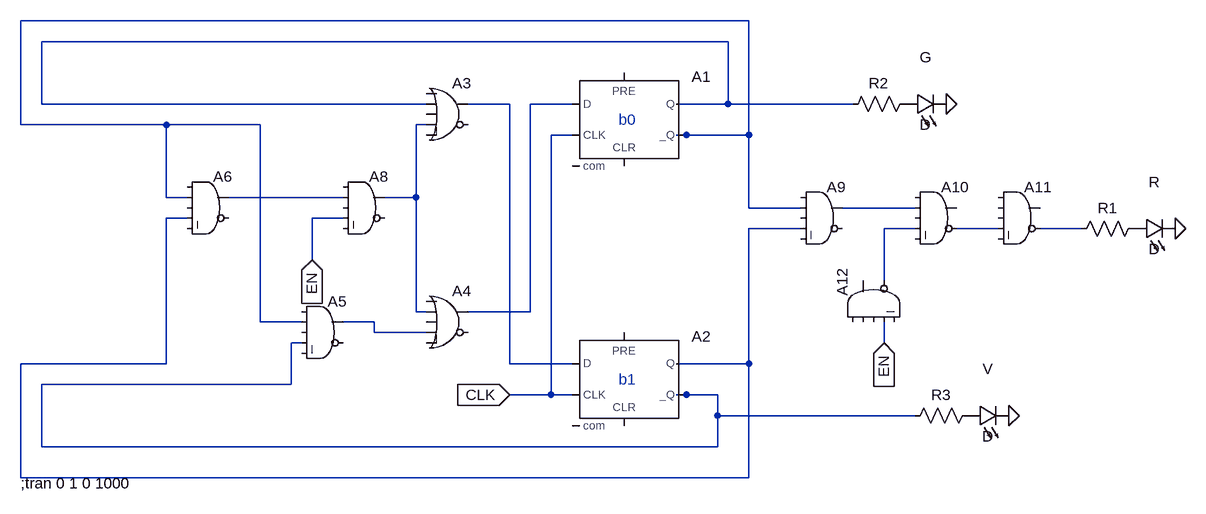
[diagram p0: schematic Circuito.asc]
Circuito.asc, the LTspice schematic file:
Version 4
SHEET 1 1156 680
WIRE 480 -96 -640 -96
WIRE 448 -64 -608 -64
WIRE -608 32 -608 -64
WIRE -16 32 -608 32
WIRE 112 32 48 32
WIRE 208 32 144 32
WIRE 448 32 448 -64
WIRE 448 32 368 32
WIRE 640 32 448 32
WIRE -640 64 -640 -96
WIRE -416 64 -640 64
WIRE -272 64 -416 64
WIRE -16 64 -32 64
WIRE 208 80 176 80
WIRE 384 80 368 80
WIRE 480 80 480 -96
WIRE 480 80 384 80
WIRE -416 176 -416 64
WIRE -384 176 -416 176
WIRE -144 176 -320 176
WIRE -32 176 -32 64
WIRE -32 176 -80 176
WIRE 480 192 480 80
WIRE 560 192 480 192
WIRE 736 192 624 192
WIRE -384 208 -416 208
WIRE -144 208 -192 208
WIRE 560 224 480 224
WIRE 736 224 688 224
WIRE 864 224 800 224
WIRE 992 224 928 224
WIRE -192 272 -192 208
WIRE 688 304 688 224
WIRE -32 352 -32 176
WIRE -16 352 -32 352
WIRE 144 352 144 32
WIRE 144 352 48 352
WIRE -272 368 -272 64
WIRE -208 368 -272 368
WIRE -96 368 -144 368
WIRE -96 384 -96 368
WIRE -16 384 -96 384
WIRE -208 400 -224 400
WIRE 688 400 688 368
WIRE -416 432 -416 208
WIRE -416 432 -640 432
WIRE 112 432 112 32
WIRE 208 432 112 432
WIRE 480 432 480 224
WIRE 480 432 368 432
WIRE -224 464 -224 400
WIRE -224 464 -608 464
WIRE 176 480 176 80
WIRE 176 480 112 480
WIRE 208 480 176 480
WIRE 384 480 368 480
WIRE 432 480 384 480
WIRE 432 512 432 480
WIRE 736 512 432 512
WIRE -608 560 -608 464
WIRE 432 560 432 512
WIRE 432 560 -608 560
WIRE -640 608 -640 432
WIRE 480 608 480 432
WIRE 480 608 -640 608
FLAG -192 272 EN
IOPIN -192 272 In
FLAG 784 32 0
FLAG 688 400 EN
IOPIN 688 400 In
FLAG 1136 224 0
FLAG 880 512 0
FLAG 112 480 CLK
IOPIN 112 480 In
SYMBOL Digital\\dflop 288 -16 R0
SYMATTR InstName A1
SYMBOL Digital\\dflop 288 384 R0
SYMATTR InstName A2
SYMBOL Digital\\or 16 -16 R0
SYMATTR InstName A3
SYMBOL Digital\\or 16 304 R0
SYMATTR InstName A4
SYMBOL Digital\\and -176 320 R0
SYMATTR InstName A5
SYMBOL Digital\\and -352 128 R0
SYMATTR InstName A6
SYMBOL Digital\\and -112 128 R0
SYMATTR InstName A8
SYMBOL res 736 16 R90
WINDOW 0 0 56 VBottom 2
WINDOW 3 32 56 VTop 2
SYMATTR InstName R2
SYMATTR Value ""
SYMBOL LED 720 48 R270
WINDOW 0 72 32 VTop 2
WINDOW 3 0 32 VBottom 2
SYMATTR InstName G
SYMBOL Digital\\and 592 144 R0
SYMATTR InstName A9
SYMBOL Digital\\and 768 144 R0
SYMATTR InstName A10
SYMBOL Digital\\and 608 336 R270
SYMATTR InstName A12
SYMBOL Digital\\and 896 144 R0
SYMATTR InstName A11
SYMBOL res 1088 208 R90
WINDOW 0 0 56 VBottom 2
WINDOW 3 32 56 VTop 2
SYMATTR InstName R1
SYMATTR Value ""
SYMBOL LED 1072 240 R270
WINDOW 0 72 32 VTop 2
WINDOW 3 0 32 VBottom 2
SYMATTR InstName R
SYMBOL res 832 496 R90
WINDOW 0 0 56 VBottom 2
WINDOW 3 32 56 VTop 2
SYMATTR InstName R3
SYMATTR Value ""
SYMBOL LED 816 528 R270
WINDOW 0 72 32 VTop 2
WINDOW 3 0 32 VBottom 2
SYMATTR InstName V
TEXT 280 56 Left 2 ;b0
TEXT 280 456 Left 2 ;b1
TEXT -640 616 Left 2 !;tran 0 1 0 1000

The netlist it stands for:
* Circuito.asc
A1 N004 0 CLK 0 0 N001 N002 0 DFLOP
A2 N003 0 CLK 0 0 N013 N008 0 DFLOP
A3 0 N002 0 N005 0 0 N003 0 OR
A4 0 N005 0 N012 0 0 N004 0 OR
A5 0 N001 0 N013 0 0 N012 0 AND
A6 0 N001 0 N008 0 0 N006 0 AND
A8 0 N006 0 EN 0 0 N005 0 AND
R2 P001 N002
D§G P001 0 D
A9 0 N001 0 N008 0 0 N007 0 AND
A10 0 N007 0 N009 0 N010 0 0 AND
A12 0 0 0 EN 0 N009 0 0 AND
A11 0 0 0 N010 0 N011 0 0 AND
R1 P002 N011
D§R P002 0 D
R3 P003 N013
D§V P003 0 D
.model D D
.lib standard.dio
* b0
* b1
;tran 0 1 0 1000
.backanno
.end